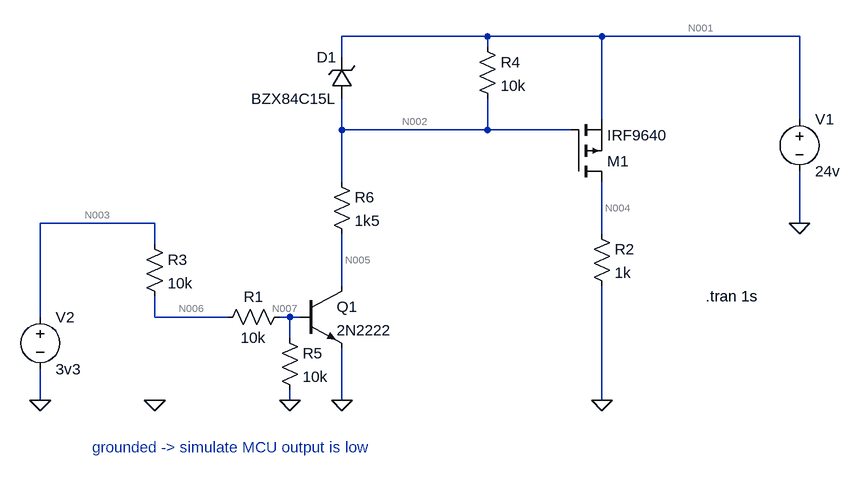
[diagram p0: schematic PWM_modul.asc]
PWM_modul.asc, the LTspice schematic file:
Version 4
SHEET 1 1080 680
WIRE 448 -352 224 -352
WIRE 624 -352 448 -352
WIRE 928 -352 624 -352
WIRE 448 -336 448 -352
WIRE 224 -320 224 -352
WIRE 624 -224 624 -352
WIRE 928 -224 928 -352
WIRE 224 -208 224 -256
WIRE 448 -208 448 -256
WIRE 448 -208 224 -208
WIRE 576 -208 448 -208
WIRE 224 -128 224 -208
WIRE -64 -64 -240 -64
WIRE 928 -64 928 -144
WIRE 624 -48 624 -128
WIRE -64 -32 -64 -64
WIRE 224 32 224 -48
WIRE -240 80 -240 -64
WIRE -64 80 -64 48
WIRE 48 80 -64 80
WIRE 144 80 128 80
WIRE 160 80 144 80
WIRE 144 112 144 80
WIRE -240 208 -240 160
WIRE 144 208 144 192
WIRE 224 208 224 128
WIRE 624 208 624 32
FLAG 224 208 0
FLAG 928 -64 0
FLAG 624 208 0
FLAG -64 208 0
FLAG -240 208 0
FLAG 144 208 0
SYMBOL pmos 576 -128 M180
SYMATTR InstName M1
SYMATTR Value IRF9640
SYMBOL res 608 -64 R0
SYMATTR InstName R2
SYMATTR Value 1k
SYMBOL voltage 928 -240 R0
WINDOW 123 0 0 Left 0
WINDOW 39 0 0 Left 0
SYMATTR InstName V1
SYMATTR Value 24v
SYMBOL npn 160 32 R0
SYMATTR InstName Q1
SYMATTR Value 2N2222
SYMBOL res 144 64 R90
WINDOW 0 0 56 VBottom 2
WINDOW 3 32 56 VTop 2
SYMATTR InstName R1
SYMATTR Value 10k
SYMBOL res -80 -48 R0
SYMATTR InstName R3
SYMATTR Value 10k
SYMBOL voltage -240 64 R0
SYMATTR InstName V2
SYMATTR Value 3v3
SYMBOL res 128 96 R0
SYMATTR InstName R5
SYMATTR Value 10k
SYMBOL res 432 -352 R0
SYMATTR InstName R4
SYMATTR Value 10k
SYMBOL res 208 -144 R0
SYMATTR InstName R6
SYMATTR Value 1k5
SYMBOL zener 240 -256 R180
WINDOW 0 24 64 Left 2
WINDOW 3 24 0 Left 2
SYMATTR InstName D1
SYMATTR Value BZX84C15L
SYMATTR Description Diode
SYMATTR Type diode
TEXT 784 48 Left 2 !.tran 1s
TEXT -160 280 Left 2 ;grounded -> simulate MCU output is low

The netlist it stands for:
* PWM_modul.asc
M1 N004 N002 N001 N001 IRF9640
R2 N004 0 1k
V1 N001 0 24v
Q1 N005 N007 0 0 2N2222
R1 N007 N006 10k
R3 N003 N006 10k
V2 N003 0 3v3
R5 N007 0 10k
R4 N001 N002 10k
R6 N002 N005 1k5
D1 N002 N001 BZX84C15L
.model D D
.lib standard.dio
.model NPN NPN
.model PNP PNP
.lib standard.bjt
.model NMOS NMOS
.model PMOS PMOS
.lib standard.mos
.tran 1s
* grounded -> simulate MCU output is low
.backanno
.end

* Results of the author's LTspice run, read from the files saved beside the schematic
* Operating Point, zero values left out:
*   V(n004) = 23.99 V
*   V(n002) = 8.774 V
*   V(n001) = 24 V
*   V(n005) = 129.8 mV
*   V(n007) = 702.9 mV
*   V(n006) = 1.851 V
*   V(n003) = 3 V
*   Ic(Q1) = 5.763 mA
*   Ib(Q1) = 44.56 µA
*   Ie(Q1) = -5.807 mA
*   Id(M1) = -23.99 mA
*   Is(M1) = 23.99 mA
*   I(D1) = -4.24 mA
*   I(R6) = 5.763 mA
*   I(R4) = 1.523 mA
*   I(R5) = 70.29 µA
*   I(R3) = 114.9 µA
*   I(R1) = -114.9 µA
*   I(R2) = 23.99 mA
*   I(V2) = -114.9 µA
*   I(V1) = -29.75 mA